# Altium schematic sheet 12_B_TO_B.SchDoc
size A3
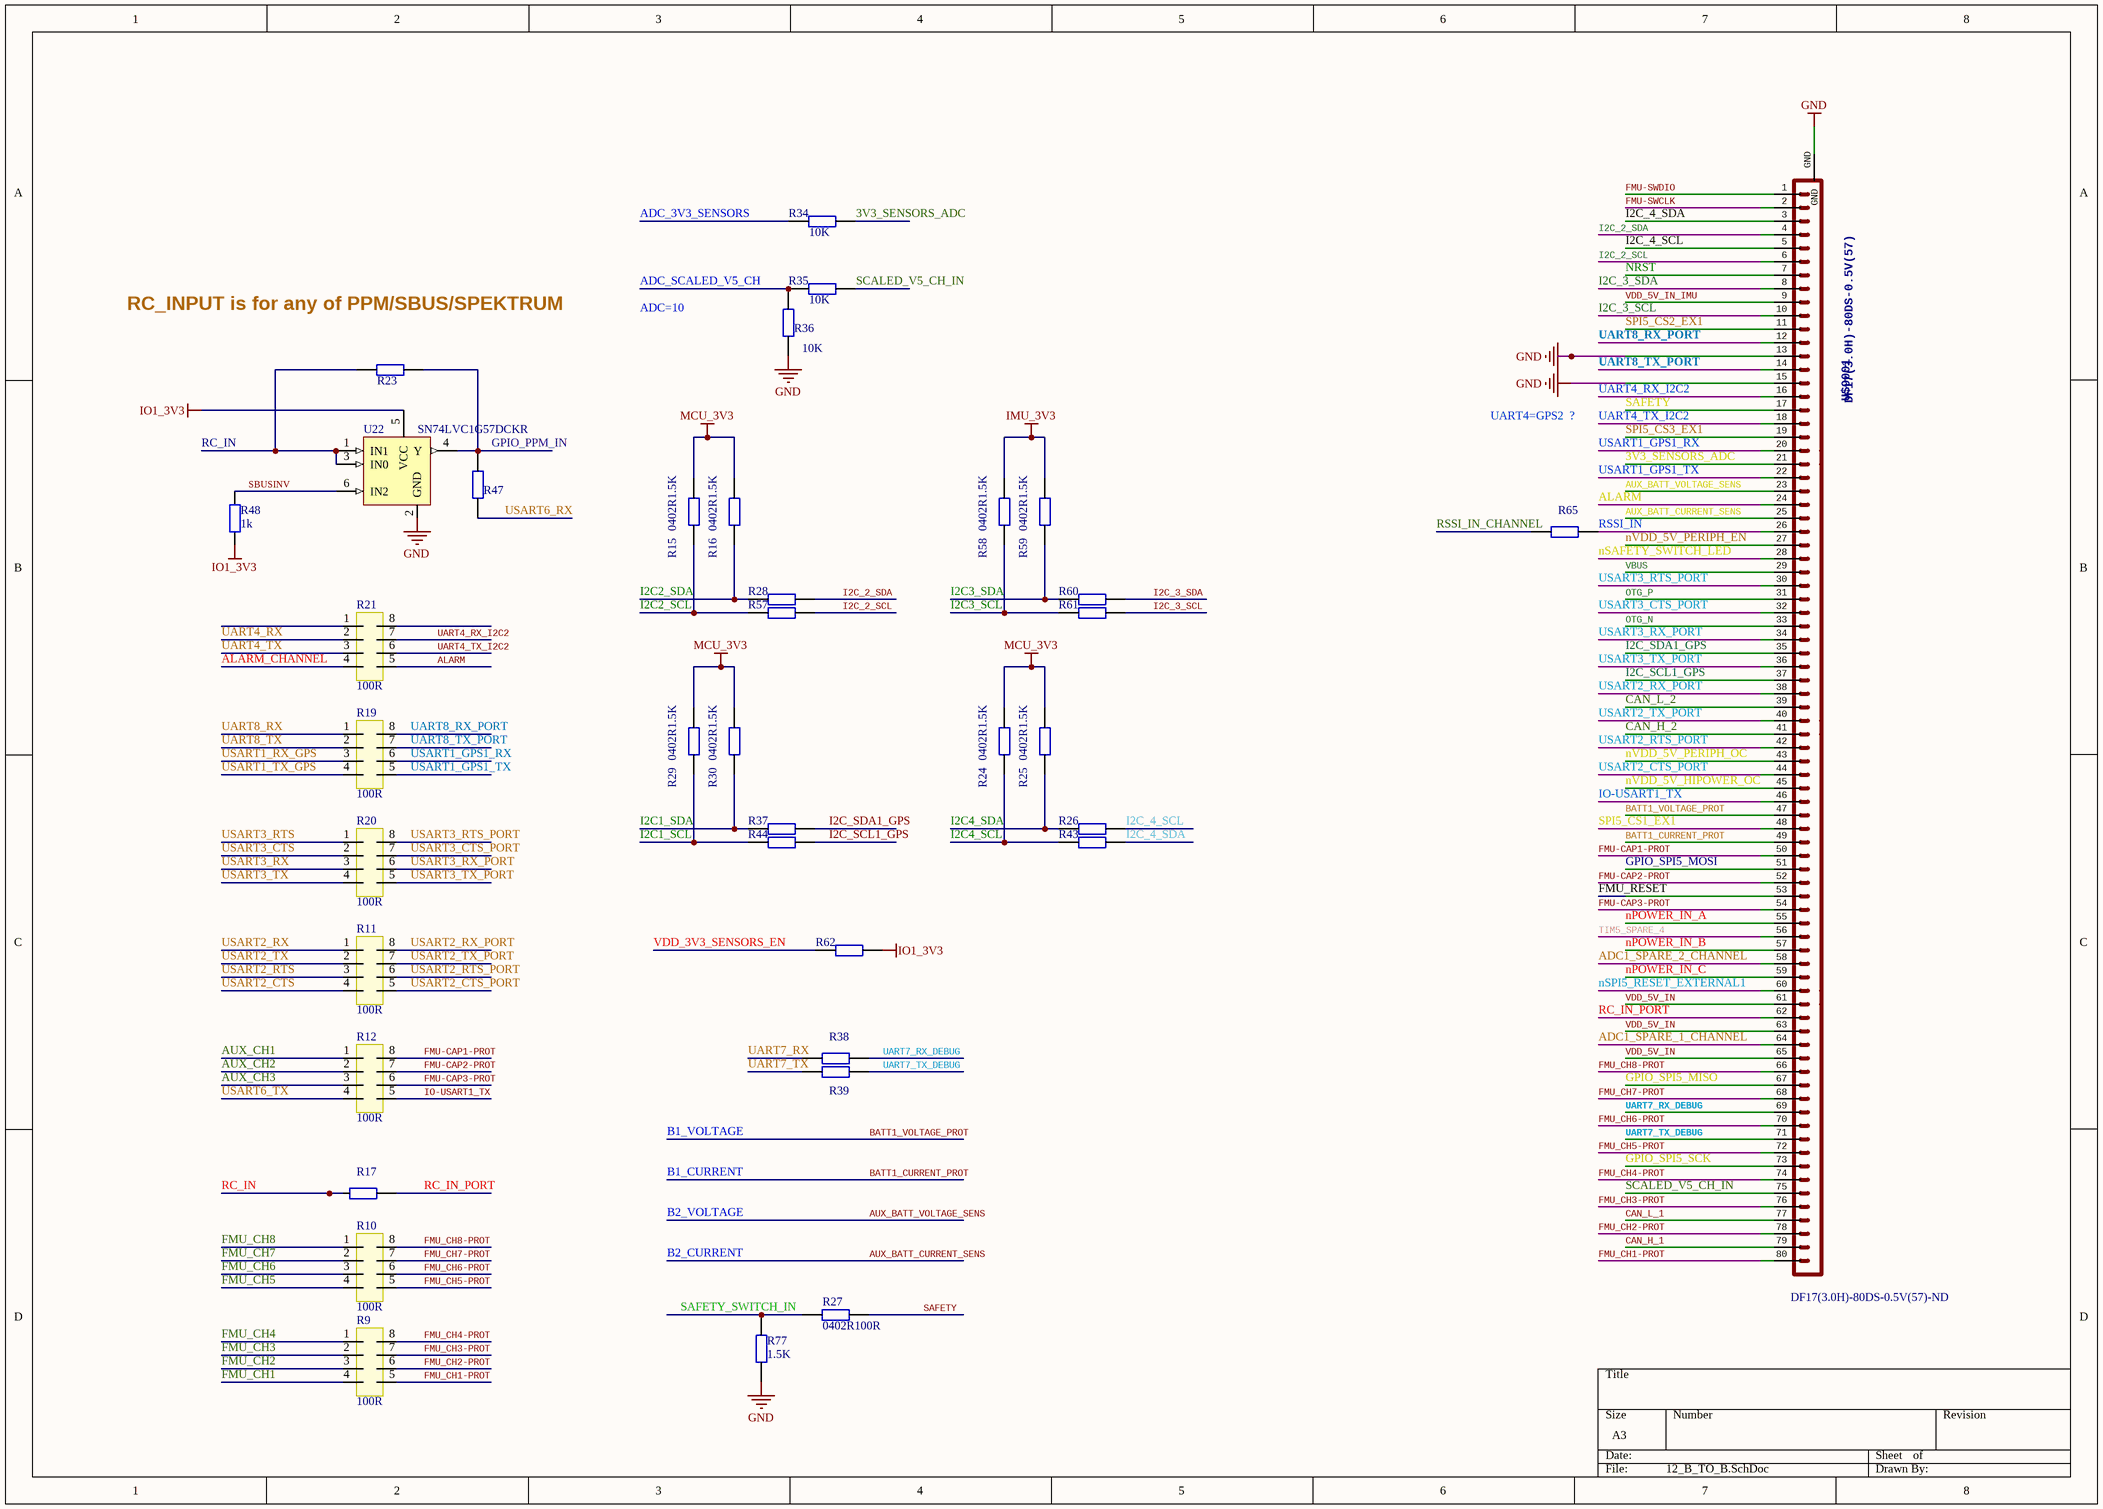
[diagram p0: 12_B_TO_B.SchDoc]

## Parts
R9  100R  [0402_4r]
R10  100R  [0402_4r]
R11  100R  [0402_4r]
R12  100R  [0402_4r]
R15  0402R1.5K  [0402R]
R16  0402R1.5K  [0402R]
R17  0402R100R  [0402R]  (value not drawn)
R19  100R  [0402_4r]
R20  100R  [0402_4r]
R21  100R  [0402_4r]
R23  100R/NC  [0402R]  (value not drawn)
R24  0402R1.5K  [0402R]
R25  0402R1.5K  [0402R]
R26  0402R100R  [0402R]  (value not drawn)
R27  0402R100R  [0402R]
R28  0402R100R  [0402R]  (value not drawn)
R29  0402R1.5K  [0402R]
R30  0402R1.5K  [0402R]
R34  10K  [0402R]
R35  10K  [0402R]
R36  10K  [0402R]
R37  0402R100R  [0402R]  (value not drawn)
R38  0402R100R  [0402R]  (value not drawn)
R39  0402R100R  [0402R]  (value not drawn)
R43  0402R100R  [0402R]  (value not drawn)
R44  0402R100R  [0402R]  (value not drawn)
R47  100R  [0402R]  (value not drawn)
R48  1k  [R0402]
R57  0402R100R  [0402R]  (value not drawn)
R58  0402R1.5K  [0402R]
R59  0402R1.5K  [0402R]
R60  0402R100R  [0402R]  (value not drawn)
R61  0402R100R  [0402R]  (value not drawn)
R62  10K/NC  [0402R]  (value not drawn)
R65  0402R100R  [0402R]  (value not drawn)
R77  1.5K  [0402R]
U22  SN74LVC1G57DCKR  [sot323-6]
U$9001  DF17(3.0H)-80DS-0.5V(57)  Supplier Part Number 1: DF17(3.0H)-80DS-0.5V(57)-ND  [DF17(3.0H)-80DS-0.5V(57)]

## Nets
GND: R36.1 R77.1 U22.2(GND) U$9001.13 U$9001.15 U$9001.GND
IMU_3V3: R58.2 R59.2
IO1_3V3: R48.1 R62.2 U22.5(VCC)
MCU_3V3: R15.2 R16.2 R24.2 R25.2 R29.2 R30.2
3V3_SENSORS_ADC: R34.2 U$9001.21
ADC1_SPARE_1_CHANNEL: U$9001.64
ADC1_SPARE_2_CHANNEL: U$9001.58
ADC_3V3_SENSORS: R34.1
ADC_SCALED_V5_CH: R35.1 R36.2
ALARM: R21.5 U$9001.24
ALARM_CHANNEL: R21.4
AUX_BATT_CURRENT_SENS: U$9001.25  [also labelled B2_CURRENT]
AUX_BATT_VOLTAGE_SENS: U$9001.23  [also labelled B2_VOLTAGE]
AUX_CH1: R12.1
AUX_CH2: R12.2
AUX_CH3: R12.3
B1_CURRENT: U$9001.49  [also labelled BATT1_CURRENT_PROT]
B1_VOLTAGE: U$9001.47  [also labelled BATT1_VOLTAGE_PROT]
CAN_H_1: U$9001.79
CAN_H_2: U$9001.41
CAN_L_1: U$9001.77
CAN_L_2: U$9001.39
FMU-CAP1-PROT: R12.8 U$9001.50
FMU-CAP2-PROT: R12.7 U$9001.52
FMU-CAP3-PROT: R12.6 U$9001.54
FMU-SWCLK: U$9001.2
FMU-SWDIO: U$9001.1
FMU_CH1: R9.4
FMU_CH1-PROT: R9.5 U$9001.80
FMU_CH2: R9.3
FMU_CH2-PROT: R9.6 U$9001.78
FMU_CH3: R9.2
FMU_CH3-PROT: R9.7 U$9001.76
FMU_CH4: R9.1
FMU_CH4-PROT: R9.8 U$9001.74
FMU_CH5: R10.4
FMU_CH5-PROT: R10.5 U$9001.72
FMU_CH6: R10.3
FMU_CH6-PROT: R10.6 U$9001.70
FMU_CH7: R10.2
FMU_CH7-PROT: R10.7 U$9001.68
FMU_CH8: R10.1
FMU_CH8-PROT: R10.8 U$9001.66
FMU_RESET: U$9001.53
GPIO_PPM_IN: R23.1 R47.2 U22.4(Y)
GPIO_SPI5_MISO: U$9001.67
GPIO_SPI5_MOSI: U$9001.51
GPIO_SPI5_SCK: U$9001.73
I2C1_SCL: R29.1 R44.1
I2C1_SDA: R30.1 R37.1
I2C2_SCL: R15.1 R57.1
I2C2_SDA: R16.1 R28.1
I2C3_SCL: R58.1 R61.1
I2C3_SDA: R59.1 R60.1
I2C4_SCL: R24.1 R43.1
I2C4_SDA: R25.1 R26.1
I2C_2_SCL: R57.2 U$9001.6
I2C_2_SDA: R28.2 U$9001.4
I2C_3_SCL: R61.2 U$9001.10
I2C_3_SDA: R60.2 U$9001.8
I2C_4_SCL: R26.2 U$9001.5
I2C_4_SDA: R43.2 U$9001.3
I2C_SCL1_GPS: R44.2 U$9001.37
I2C_SDA1_GPS: R37.2 U$9001.35
IO-USART1_TX: R12.5 U$9001.46
nPOWER_IN_A: U$9001.55
nPOWER_IN_B: U$9001.57
nPOWER_IN_C: U$9001.59
NRST: U$9001.7
nSAFETY_SWITCH_LED: U$9001.28
nSPI5_RESET_EXTERNAL1: U$9001.60
nVDD_5V_HIPOWER_OC: U$9001.45
nVDD_5V_PERIPH_EN: U$9001.27
nVDD_5V_PERIPH_OC: U$9001.43
OTG_N: U$9001.33
OTG_P: U$9001.31
RC_IN: R17.1 R23.2 U22.1(IN1) U22.3(IN0)
RC_IN_PORT: R17.2 U$9001.62
RSSI_IN: R65.2 U$9001.26
RSSI_IN_CHANNEL: R65.1
SAFETY: R27.2 U$9001.17
SAFETY_SWITCH_IN: R27.1 R77.2
SBUSINV: R48.2 U22.6(IN2)
SCALED_V5_CH_IN: R35.2 U$9001.75
SPI5_CS1_EX1: U$9001.48
SPI5_CS2_EX1: U$9001.11
SPI5_CS3_EX1: U$9001.19
TIM5_SPARE_4: U$9001.56
UART4_RX: R21.2
UART4_RX_I2C2: R21.7 U$9001.16
UART4_TX: R21.3
UART4_TX_I2C2: R21.6 U$9001.18
UART7_RX: R38.1
UART7_RX_DEBUG: R38.2 U$9001.69
UART7_TX: R39.1
UART7_TX_DEBUG: R39.2 U$9001.71
UART8_RX: R19.1
UART8_RX_PORT: R19.8 U$9001.12
UART8_TX: R19.2
UART8_TX_PORT: R19.7 U$9001.14
USART1_GPS1_RX: R19.6 U$9001.20
USART1_GPS1_TX: R19.5 U$9001.22
USART1_RX_GPS: R19.3
USART1_TX_GPS: R19.4
USART2_CTS: R11.4
USART2_CTS_PORT: R11.5 U$9001.44
USART2_RTS: R11.3
USART2_RTS_PORT: R11.6 U$9001.42
USART2_RX: R11.1
USART2_RX_PORT: R11.8 U$9001.38
USART2_TX: R11.2
USART2_TX_PORT: R11.7 U$9001.40
USART3_CTS: R20.2
USART3_CTS_PORT: R20.7 U$9001.32
USART3_RTS: R20.1
USART3_RTS_PORT: R20.8 U$9001.30
USART3_RX: R20.3
USART3_RX_PORT: R20.6 U$9001.34
USART3_TX: R20.4
USART3_TX_PORT: R20.5 U$9001.36
USART6_RX: R47.1
USART6_TX: R12.4
VBUS: U$9001.29
VDD_3V3_SENSORS_EN: R62.1
VDD_5V_IN: U$9001.61 U$9001.63 U$9001.65
VDD_5V_IN_IMU: U$9001.9

Not connected (* = marked no-connect by the designer): R21 1 8

## Notes on the sheet
- RC_INPUT is for any of PPM/SBUS/SPEKTRUM
- Labels drawn without touching a wire or pin: ADC=10, UART4=GPS2  ?

## Library data of the parts
R9-R12 R19-R21 = 0402-8R-4R
R15 R16 R24 R25 R29 R30 R58 R59 = 0402R10K: 0402R10K 1%
R17 R23 R26-R28 R34-R39 R43 R44 R47 R57 R60-R62 R65 R77 = 0402R100R: 0402R100R 1%
R48 = Res2: Resistor; Published: 8-Jun-2000; LatestRevisionDate: 17-Jul-2002; LatestRevisionNote: Re-released for DXP Platform.; PackageReference: AXIAL-0.4; Publisher: Altium Limited; PackageDescription: Axial Device, Thru-Hole; 2 Leads; 0.4 in Pin Spacing; Value: 1K
U22 = 74LVC1G57
U$9001 = CON-DF17-80F